# Altium schematic sheet DisplayReceiver_Perpiph.SchDoc: Инфракрасный передатчик
size 420 x 297 mm; ApprovedBy: Чукалкин; CheckedBy: Суворов; DrawnBy: Подлесный; DocumentNumber: ФНКЦ.542321.001 Э3; SheetNumber: 1; SheetTotal: 4; DocumentType: Схема электрическая принципиальная; Format: A3; ImagePath: ФНКЦ.542321.001
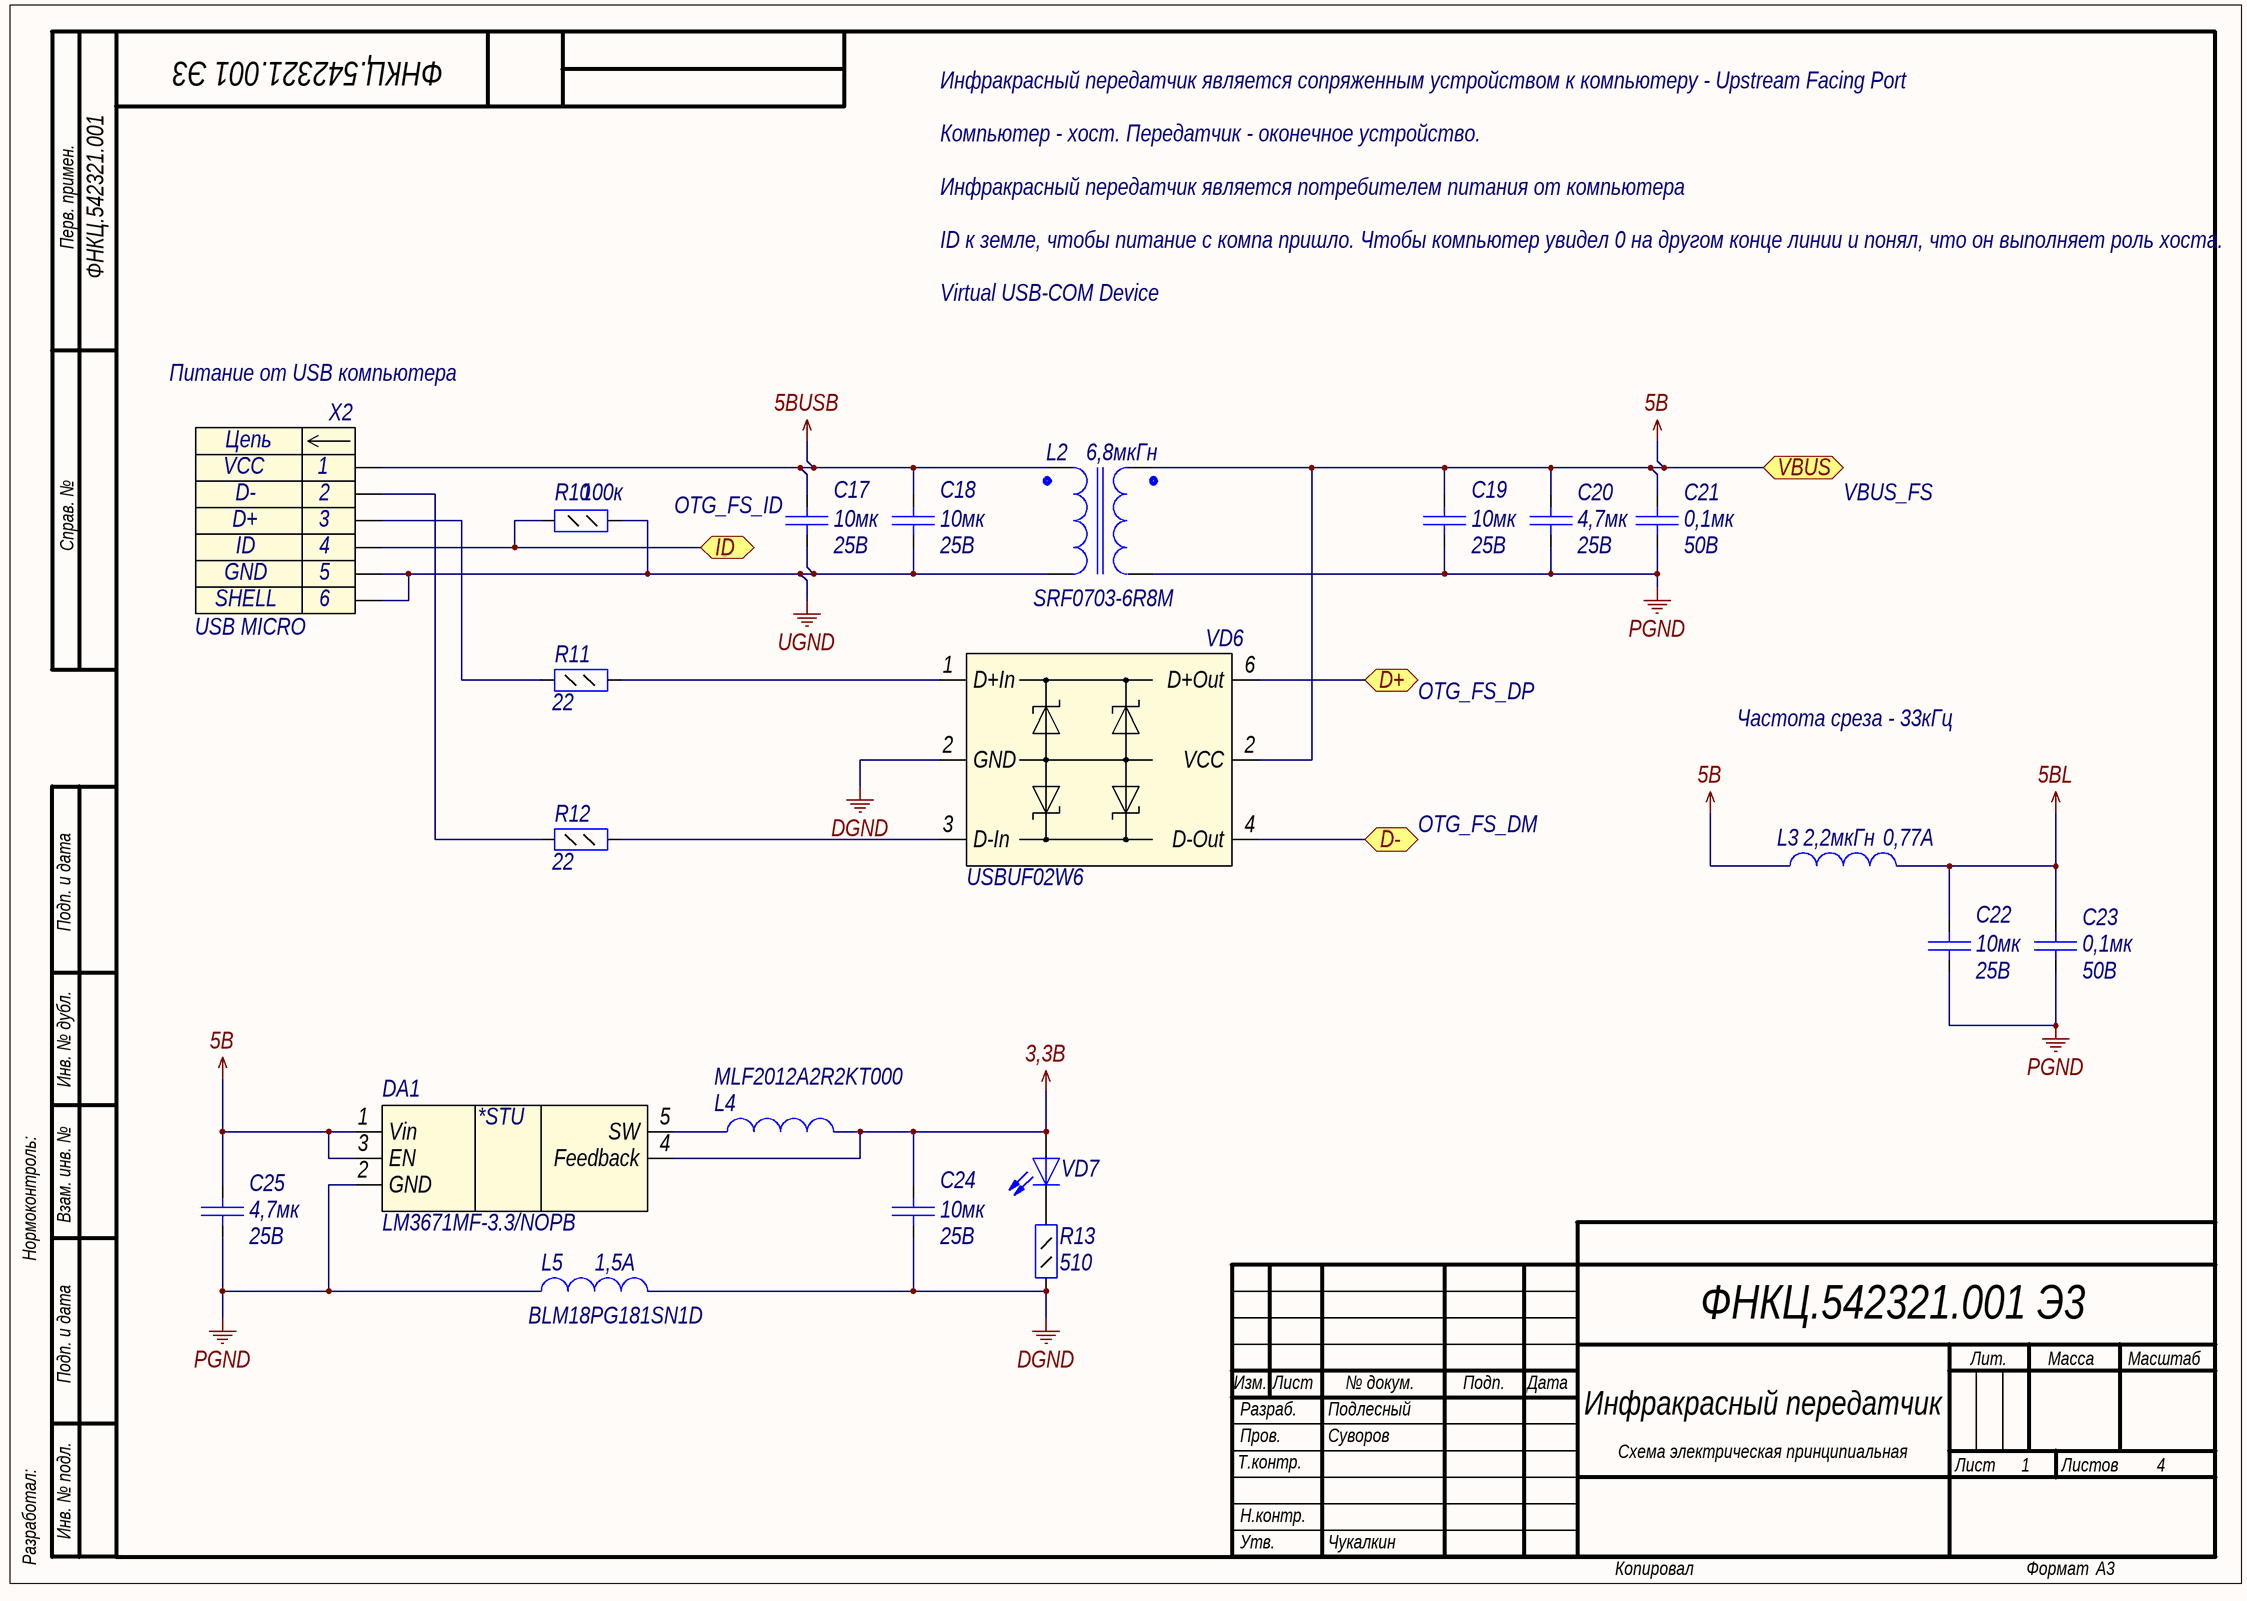
[diagram p0: DisplayReceiver_Perpiph.SchDoc]

## Parts
C17  value 10мк  Voltage: 25В  [C1206]  (hidden comment: Capacitor)
C18  value 10мк  Voltage: 25В  [C1206]  (hidden comment: Capacitor)
C19  value 10мк  Voltage: 25В  [C1206]  (hidden comment: Capacitor)
C20  value 4,7мк  Voltage: 25B  [C0805]  (hidden comment: Capacitor)
C21  value 0,1мк  Voltage: 50B  [C0805]  (hidden comment: Capacitor)
C22  value 10мк  Voltage: 25В  [C1206]  (hidden comment: Capacitor)
C23  value 0,1мк  Voltage: 50B  [C0805]  (hidden comment: Capacitor)
C24  value 10мк  Voltage: 25В  [C1206]  (hidden comment: Capacitor)
C25  value 4,7мк  Voltage: 25B  [C0805]  (hidden comment: Capacitor)
DA1  LM3671MF-3.3/NOPB  [SOT23-5]
L2  value 6,8мкГн  Part Number: SRF0703-6R8M  [SRF0703]  (hidden comment: Dual-Winding Inductor)
L3  value 2,2мкГн  Rated Current: 0,77A  [L1210]  (hidden comment: Inductor)
L4  Part Number: MLF2012A2R2KT000  [L0805]  (hidden comment: Inductor)
L5  Rated Current: 1,5A  Part Number: BLM18PG181SN1D  [L0603]  (hidden comment: Inductor)
R10  value 100к  [R0805]  (hidden comment: Resistor_0,125Вт)
R11  value 22  [R0805]  (hidden comment: Resistor_0,125Вт)
R12  value 22  [R0805]  (hidden comment: Resistor_0,125Вт)
R13  value 510  [R0805]  (hidden comment: Resistor_0,125Вт)
VD6  Part Number: USBUF02W6  [SOT323-6L]  (hidden comment: USBUF)
VD7  LED  [L_0805]  (value not drawn)
X2  USB MICRO  [USB-B Micro]

## Ports
D+, D-, ID, VBUS

## Nets
3,3В: C24.2 DA1.4(Feedback) L4.2 VD7.2(A)
5В: C19.2 C20.2 C21.2 C25.2 DA1.1(Vin) DA1.3(EN) L2.2 L3.1 VD6.2(VCC) ; port VBUS
5ВL: C22.2 C23.2 L3.2
5ВUSB: C17.2 C18.2 L2.1 X2.1
DGND: C24.1 L5.2 R13.1 VD6.2(GND)
PGND: C19.1 C20.1 C21.1 C22.1 C23.1 C25.1 DA1.2(GND) L2.4 L5.1
UGND: C17.1 C18.1 L2.3 R10.1 X2.5 X2.6
D+: VD6.6(D+Out) ; port D+
D-: VD6.4(D-Out) ; port D-
ID: R10.2 X2.4 ; port ID
NetDA1_5: DA1.5(SW) L4.1
NetR11_1: R11.1 X2.3
NetR11_2: R11.2 VD6.1(D+In)
NetR12_1: R12.1 X2.2
NetR12_2: R12.2 VD6.3(D-In)
NetR13_2: R13.2 VD7.1(K)

## Notes on the sheet
- Инфракрасный передатчик является сопряженным устройством к компьютеру - Upstream Facing Port
- Перв. примен.
- Компьютер - хост. Передатчик - оконечное устройство.
- Инфракрасный передатчик является потребителем питания от компьютера
- ID к земле, чтобы питание с компа пришло. Чтобы компьютер увидел 0 на другом конце линии и понял, что он выполняет роль хоста.
- Virtual USB-COM Device
- Питание от USB компьютера
- Справ. №
- (near C17) OTG_FS_ID
- VBUS_FS
- OTG_FS_DP
- Частота среза - 33кГц
- OTG_FS_DM
- Подп. и дата
- Инв. № дубл.
- Нормоконтроль:
- Взам. инв. №
- Изм.
- Лист
- № докум.
- Подп.
- Дата
- Лит.
- Масса
- Масштаб
- Т.контр.
- Пров.
- Разраб.
- Листов
- Разработал:
- Инв. № подл.
- Н.контр.
- Утв.
- Копировал
- Формат
- (in symbol connect2) Цепь; SHELL
- (in symbol pwr2) *STU

## Library data of the parts
C17-C19 C22 C24 = cap187: Конденсатор; Part Name: Ceramic; Manufacture: Murata; Part Number: GRM31CR71E106KA12L*; id: cap187; TKE: X7R
C20 C25 = cap154: Конденсатор; Part Name: Ceramic; Manufacture: Murata; Part Number: GRM21BR61E475KA12L; id: cap154; TKE: X5R
C21 C23 = cap142: Конденсатор; Part Name: Ceramic; Manufacture: Murata; Part Number: GRM21BR71H104K**; id: cap142; TKE: X7R
DA1 = pwr2: Step-Down DC-DC Converter; Part Name: 600-mA Step-Down DC-DC Converter; Manufacturer: Texas Instruments; id: pwr2; Input Voltage: 2,7 - 5,5B; Output Voltage: 3,3B; Current: 0,6A; Type: Impulse; Part Number: LM3671MF-3.3/NOPB
L2 = ind15: Синфазный дроссель; Part Name: Dual-Winding Shielded Power Inductors; Manufacture: Bourns; Rated Current: 2,55A; id: ind15; Saturation Current: 3,12A; Resistance: 0.0658Ohm
L3 = ind1: EMI Suppression Filter; Part Number: NLCV32T-2R2M-EF; id: ind1; Resistance: 0,13Ohm; q-factor: 10; Part Name: Inductor
L4 = ind4: EMI Suppression Filter; Manufacture: Mouser; id: ind4; Resistance: 500mOhm; Part Name: Inductor
L5 = ind0: EMI Suppression Filter; Part Name: EMI Suppression Filters; id: ind0; Resistance: 0,09Ohm
R10 = res121: Резистор; Manufacture: Yageo; Part Number: RC0805FR-07100KL; id: res121; Accuracy: 1%; Part Name: Resistor; Power: 0,125Вт
R11 R12 = res33: Резистор; Manufacture: Yageo; Part Number: RC0805FR-0722RL; id: res33; Accuracy: 1%; Part Name: Resistor; Power: 0,125Вт
R13 = res66: Резистор; Manufacture: Yageo; Part Number: RC0805FR-07510RL; id: res66; Accuracy: 1%; Part Name: Resistor; Power: 0,125Вт
VD6 = diode23: EMEMI filter and line termination for USB upstream ports; Part Name: EMI filter for USB upstream ports; Manufacture: ST Microelectronics; Capacitance: 47pF; Number of Channels: 2; id: diode23
VD7 = diode8: Светодиод; Part Number: KP-2012EC; id: diode8; Part Name: LED
X2 = connect2: Part Name: Micro USB 5S-B; Part Number: KLS1-233-0-0-1-T; Contact_1: VCC; Contact_2: D-; Contact_3: D+; Contact_4: ID; Contact_5: GND; Contact_6: Shell; id: connect2